# EAGLE design minisumo_sensor (EAGLE 9.4.2)
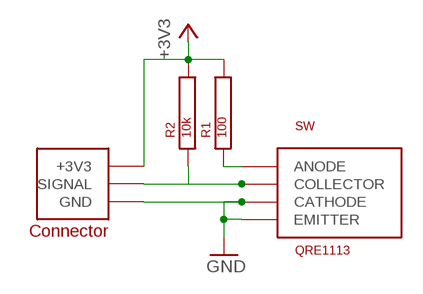
[diagram p0: schematic, sheet 1]

## Parts
R1  100  RESISTOR  [RES_0402]
R2  10k  RESISTOR  [RES_0402]
SW  QRE1113  [QRE1113]
U$1  QRE1113_CONNECTOR  [QRE1113_CONNECTOR]

## Nets
+3V3: R1.P$2 R2.P$2 U$1.+3V3
GND: SW.CATHODE SW.EMITTER U$1.GND
N$1: R2.P$1 SW.COLLECTOR U$1.SIGNAL
N$9: R1.P$1 SW.ANODE

## Library data of the parts
R1 R2 = TimeExpander2:RESISTOR
SW = TimeExpander2:QRE1113
U$1 = TimeExpander2:QRE1113_CONNECTOR

## Board
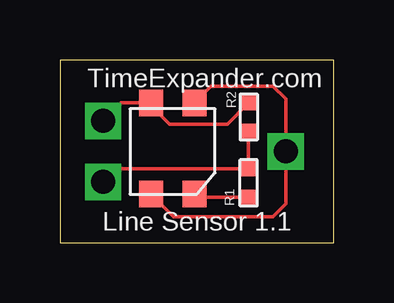
[diagram p1: board, top side]

Size 11.43 x 7.62 mm. Coordinates in mm from the lower left corner, seen from the top.
Outline: 0,0 11.43,0 11.43,7.62 0,7.62 0,0
Copper layers (1*16): Top 0.035mm / dielectric 1.5mm / Bottom 0.035mm
Design rules "default": minimum track width 6mil, minimum drill 0.35mm, track to track 6mil, track to pad 6mil, pad to pad 6mil, via to via 6mil, smd to smd 6mil, copper to edge 40mil, drill to drill 6mil, minimum pad ring 10mil, minimum via ring 8mil, stop-mask expansion 4mil, vias tented up to drill 0mil, thermal gap 10mil

### Footprints (pad centres in the part's own frame; a part is rotated, then mirrored left to right if it is on the bottom)
RES_0402 = smd 0.635 x 0.61: P$1 0,0; P$2 1.194,0
QRE1113 = smd 1.1 x 1: ANODE 0,-1.8; CATHODE 3.8,-1.8; COLLECTOR 3.8,0; EMITTER 0,0
QRE1113_CONNECTOR = drill 1 square: +3V3 0,-2.54; GND 7.62,-1.27; SIGNAL 0,0

### Placement (x,y rotation side)
R1  7.87,1.91 90 top
R2  7.87,5.84 270 top
SW  3.81,2.03 90 top
U$1  1.8,5.08 0 top

### Tracks (layer width: path | path; a pad name or v marks a point on that pad's centre or on a via)
+3V3
  Top 0.152: U$1.+3V3 2.36,3.1 R1.P$2 R2.P$2
GND
  Top 0.152: SW.EMITTER 4.75,1.09 8.89,1.09 9.42,1.62 U$1.GND 9.42,6 8.89,6.53 6.31,6.53 SW.CATHODE
N$1
  Top 0.152: U$1.SIGNAL 2.55,5.83 SW.COLLECTOR 3.81,5.71 4.57,4.95 6.99,4.95 R2.P$1
N$9
  Top 0.152: R1.P$1 5.74,1.91 SW.ANODE

### Text on the board
tPlace: TimeExpander.com | Line Sensor 1.1